# EAGLE design mono mainB (EAGLE 7.4.0)
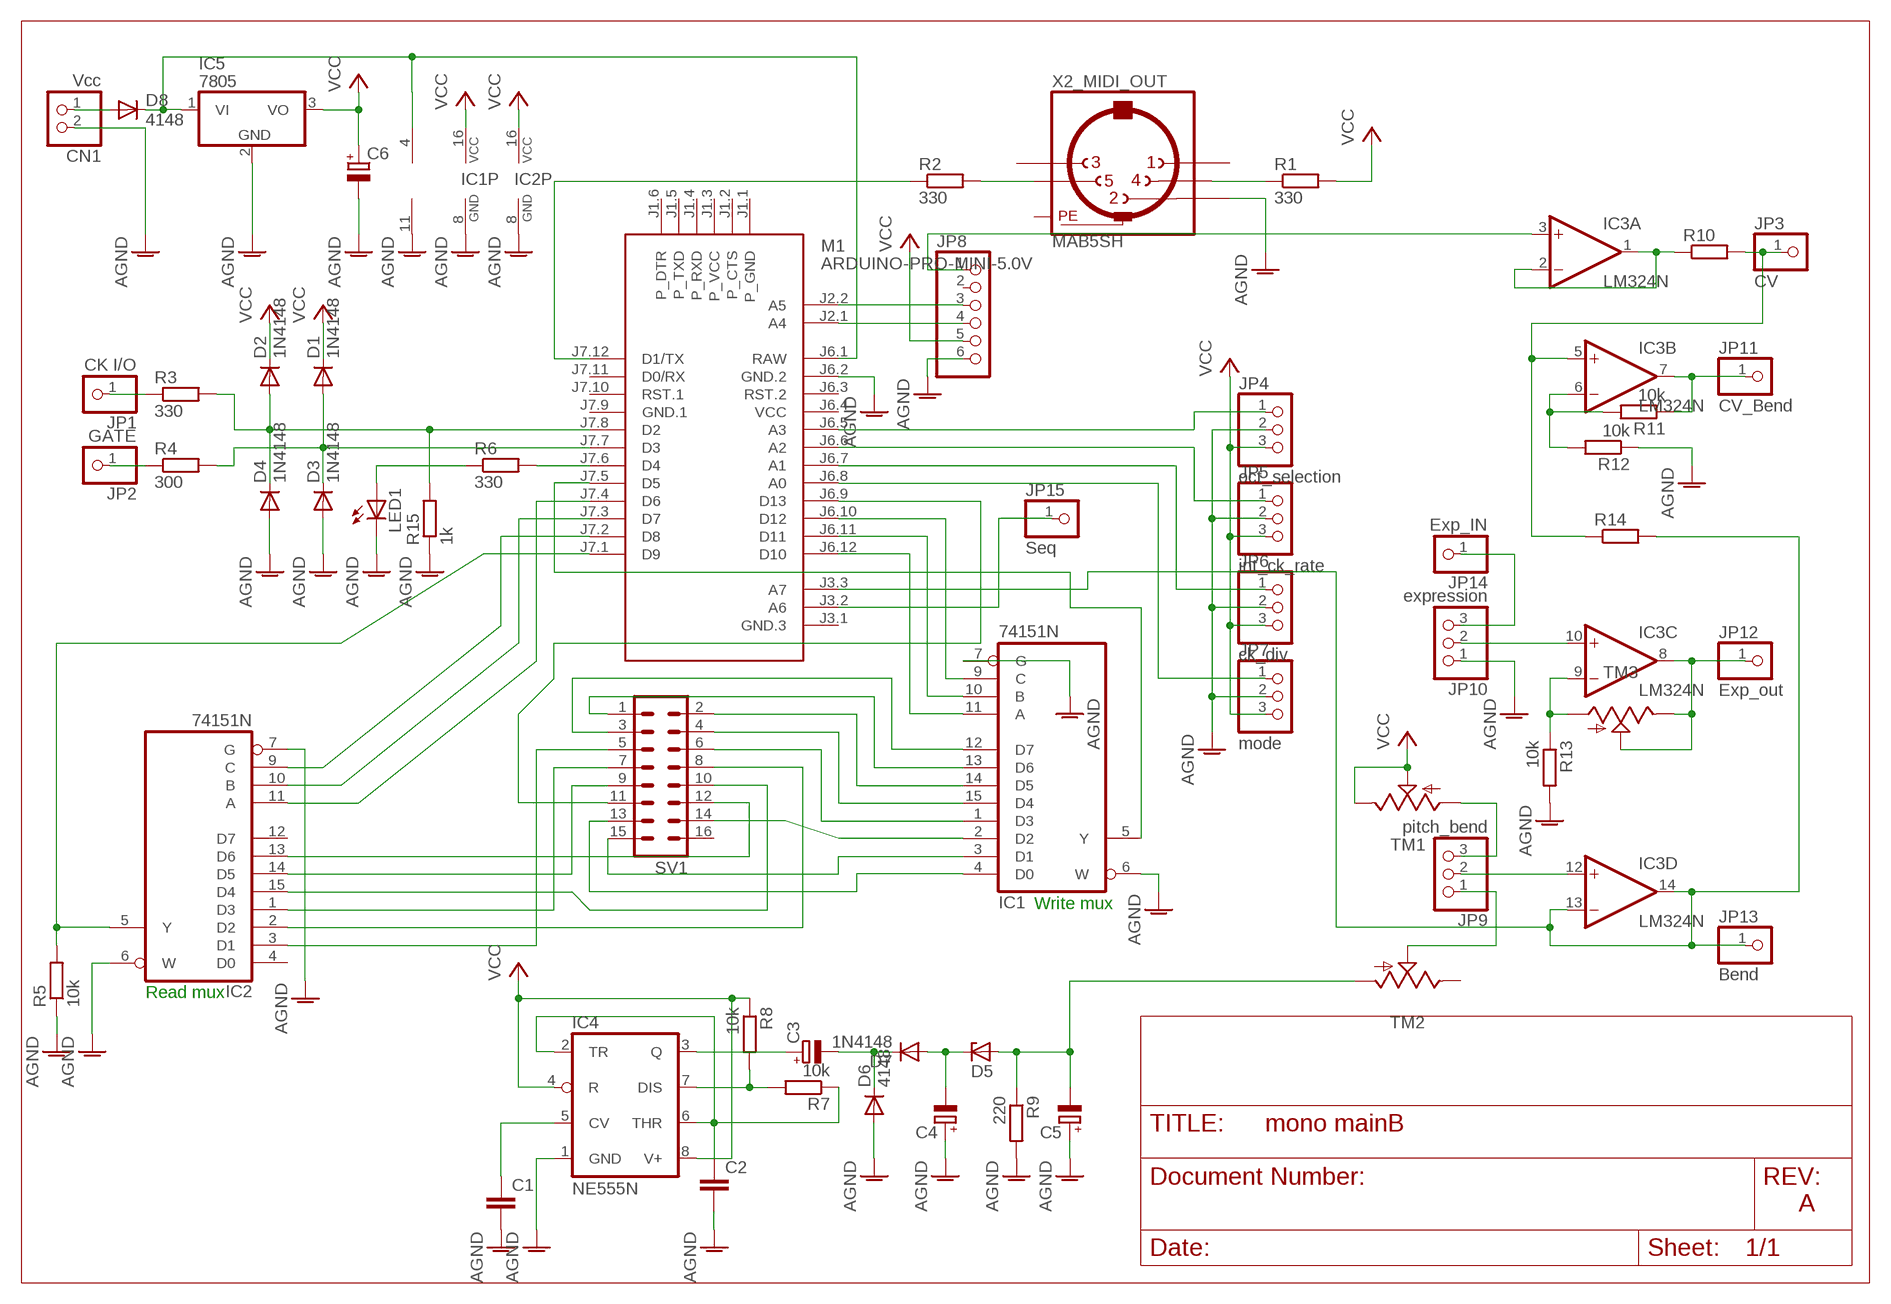
[diagram p0: schematic, sheet 1]

## Parts
C1  C-EU050-025X075  [C050-025X075]
C2  C-EU050-025X075  [C050-025X075]
C3  CPOL-EUE5-8.5  [E5-8,5]
C4  CPOL-EUE5-8.5  [E5-8,5]
C5  CPOL-EUE5-8.5  [E5-8,5]
C6  CPOL-EUE5-8.5  [E5-8,5]
CN1  Vcc  JST_2PIN-THM  [JST-PH-2-THM]
D1  1N4148  1N4148DO35-7  [DO35-7]
D2  1N4148  1N4148DO35-7  [DO35-7]
D3  1N4148  1N4148DO35-7  [DO35-7]
D4  1N4148  1N4148DO35-7  [DO35-7]
D5  ZENER-DIODEZD-7.5  [ZDIO-7.5]
D6  4148  1N4148DO35-7  [DO35-7]
D7  1N4148  1N4148DO35-7  [DO35-7]
D8  4148  1N4148DO35-7  [DO35-7]
IC1  74151N  [DIL16]
IC2  74151N  [DIL16]
IC3  LM324N  [DIL14]
IC4  NE555N  [DIL08-ROUND]
IC5  7805  7805TV  [TO220V]
JP1  CK I/O  PINHD-1X1  [1X01]
JP2  GATE  PINHD-1X1  [1X01]
JP3  CV  PINHD-1X1  [1X01]
JP4  oct_selection  PINHD-1X3  [1X03]
JP5  int_ck_rate  PINHD-1X3  [1X03]
JP6  ck_div  PINHD-1X3  [1X03]
JP7  mode  PINHD-1X3  [1X03]
JP8  PINHD-1X6  [1X06]
JP9  pitch_bend  PINHD-1X3  [1X03]
JP10  expression  PINHD-1X3  [1X03]
JP11  CV_Bend  PINHD-1X1  [1X01]
JP12  Exp_out  PINHD-1X1  [1X01]
JP13  Bend  PINHD-1X1  [1X01]
JP14  Exp_IN  PINHD-1X1  [1X01]
JP15  Seq  PINHD-1X1  [1X01]
LED1  LED5MM  [LED5MM]
M1  ARDUINO-PRO-MINI-5.0V  [ARDUINO-PRO-MINI]
R1  330  R-EU_0204/2V  [0204V]
R2  330  R-EU_0204/7  [0204/7]
R3  330  R0204/7  [0204/7]
R4  300  R0204/7  [0204/7]
R5  10k  R-EU_0204/7  [0204/7]
R6  330  R-EU_0207/10  [0207/10]
R7  10k  R-EU_0204/2V  [0204V]
R8  10k  R-EU_0204/2V  [0204V]
R9  220  R-EU_0204/2V  [0204V]
R10  R0204/7  [0204/7]
R11  10k  R-EU_0204/2V  [0204V]
R12  10k  R-EU_0207/10  [0207/10]
R13  10k  R-EU_0207/10  [0207/10]
R14  R0204/7  [0204/7]
R15  1k  R0204/7  [0204/7]
SV1  MA08-2  [MA08-2]
TM1  TRIM  [6MM]
TM2  TRIM  [6MM]
TM3  TRIM  [6MM]
X2_MIDI_OUT  MAB5SH  [MAB5SH]

## Nets
AGND: C1.2 C2.2 C4.+ C5.+ C6.- CN1.2 D3.A D4.A D6.A IC1.6(W) IC1.7(G) IC1.8(GND) IC2.6(W) IC2.7(G) IC2.8(GND) IC3.11(P:V-) IC4.1(GND) IC5.2(GND) JP4.2 JP5.2 JP6.2 JP7.2 JP8.6 JP10.1 LED1.K(C) M1.J6.2(GND.2) R5.1 R9.2 R12.1 R13.2 R15.1 X2_MIDI_OUT.2
N$1: IC1.12(D7) SV1.3
N$2: IC1.13(D6) SV1.1
N$3: IC1.14(D5) SV1.2
N$4: IC1.15(D4) SV1.4
N$5: IC1.1(D3) SV1.6
N$6: IC1.4(D0) SV1.13
N$7: IC1.2(D2) SV1.14
N$8: IC1.3(D1) SV1.15
N$11: IC2.13(D6) SV1.12
N$12: IC2.14(D5) SV1.9
N$13: IC2.15(D4) SV1.10
N$14: IC2.1(D3) SV1.7
N$15: IC2.2(D2) SV1.8
N$16: JP1.1 R3.1
N$17: IC1.11(A) M1.J6.12(D10)
N$18: IC1.10(B) M1.J6.11(D11)
N$19: M1.J7.12(D1/TX) R2.1
N$20: IC2.3(D1) SV1.5
N$21: JP8.3 M1.J2.2(A5)
N$22: D2.A D4.C M1.J7.8(D2) R3.2 R15.2
N$23: D1.A D3.C M1.J7.7(D3) R4.2
N$24: IC2.5(Y) M1.J7.1(D9) R5.2
N$25: IC1.5(Y) M1.J7.5(D5)
N$26: JP6.1 M1.J6.7(A1)
N$27: JP5.1 M1.J6.6(A2)
N$28: JP2.1 R4.1
N$29: JP8.4 M1.J2.1(A4)
N$30: R2.2 X2_MIDI_OUT.5
N$31: R1.1 X2_MIDI_OUT.4
N$33: IC3.9(C:-IN) R13.1 TM3.A
N$34: JP4.1 M1.J6.5(A3)
N$35: IC2.9(C) M1.J7.2(D8)
N$36: IC2.10(B) M1.J7.3(D7)
N$37: IC2.11(A) M1.J7.4(D6)
N$38: LED1.A R6.1
N$39: M1.J7.6(D4) R6.2
N$40: IC4.7(DIS) R7.2 R8.2
N$41: C2.1 IC4.2(TR) IC4.6(THR) R7.1
N$42: C1.1 IC4.5(CV)
N$43: IC3.1(A:OUT) IC3.2(A:-IN) R10.1
N$44: C3.+ IC4.3(Q)
N$45: C3.- D6.C D7.C
N$46: C4.- D5.C D7.A
N$47: C5.- D5.A R9.1 TM2.A
N$48: IC3.12(D:+IN) JP9.2
N$49: IC3.13(D:-IN) IC3.14(D:OUT) JP13.1 M1.J3.3(A7) R14.2
N$50: JP9.3 TM1.A
N$51: IC3.10(C:+IN) JP10.2
N$52: IC3.8(C:OUT) JP12.1 TM3.E TM3.S
N$53: CN1.1 D8.A
N$54: JP9.1 TM2.S
N$55: IC3.6(B:-IN) R11.2 R12.2
N$56: IC3.7(B:OUT) JP11.1 R11.1
N$57: D8.C IC3.4(P:V+) IC5.1(VI) M1.J6.1(RAW)
N$58: IC1.9(C) M1.J6.10(D12)
N$59: IC3.3(A:+IN) JP8.1
N$60: IC3.5(B:+IN) JP3.1 R10.2 R14.1
N$61: JP10.3 JP14.1
N$62: M1.J6.9(D13) SV1.11
N$67: JP7.1 M1.J6.8(A0)
N$70: JP15.1 M1.J3.2(A6)
VCC: C6.+ D1.C D2.C IC1.16(VCC) IC2.16(VCC) IC4.4(R) IC4.8(V+) IC5.3(VO) JP4.3 JP5.3 JP6.3 JP7.3 JP8.5 R1.2 R8.1 TM1.E TM1.S
Unconnected: IC2.4(D0) IC2.12(D7) JP8.2 M1.J1.1(P_GND) M1.J1.2(P_CTS) M1.J1.3(P_VCC) M1.J1.4(P_RXD) M1.J1.5(P_TXD) M1.J1.6(P_DTR) M1.J3.1(GND.3) M1.J6.3(RST.2) M1.J7.10(RST.1) M1.J7.11(D0/RX) SV1.16 TM2.E X2_MIDI_OUT.1 X2_MIDI_OUT.3

## Notes on the sheet
- Write mux
- Read mux
- A

## Power pins joined to a net without a drawn wire
GND.1: M1.J7.9(GND.1)
PE: X2_MIDI_OUT.PE X2_MIDI_OUT.PE@(PE)
VCC: M1.J6.4(VCC)

## Library data of the parts
C1 C2 = rcl:C-EU: CAPACITOR, European symbol
C3-C6 = rcl:CPOL-EU: POLARIZED CAPACITOR, European symbol
CN1 = adafruit:JST_2PIN: JST 2-Pin Connectors of various flavors SMT-RA (S2B-PH-SM4) 4UConnector #17311 SMT (B2B-PH-SM4) THM-RA (S2B-PH) THM (B2B-PH)
D1-D4 D6-D8 = diode:1N4148: DIODE high speed (Philips)
D5 = diode:ZENER-DIODE: Z-Diode
IC1 IC2 = 74xx-eu:74*151: Data SELECTOR/MULTIPLEXER
IC3 = linear:LM324: OP AMP
IC4 = adafruit:*555: TIMER Changed DIP package to have round (not oval) pin pads http://www.ladyada.net/library/pcb/eaglelibrary.html
IC5 = linear:78*: Positive VOLTAGE REGULATOR Source: http://cache.national.com/ds/LM/LM78L05.pdf http://www.fairchildsemi.com/ds/LM/LM7805.pdf
JP1-JP3 JP11-JP15 = adafruit:PINHD-1X1: Pin header 1x1 for 0.1" spacing With round pins
JP4-JP7 JP9 JP10 = adafruit:PINHD-1X3: PIN HEADER
JP8 = adafruit:PINHD-1X6: PIN HEADER
LED1 = adafruit:LED: LED OSRAM: - CHIPLED LG R971, LG N971, LY N971, LG Q971, LY Q971, LO R971, LY R971 LH N974, LH R974 LS Q976, LO Q976, LY Q976 LO Q996 - Hyper CHIPLED LW Q18S LB Q993, LB Q99A, LB R99A - SideLED LS A670, LO A670, LY A670, LG A670, LP A670 LB A673, LV A673, LT A673, LW A673 LH A674 LY A675 LS A676, LA A676, LO A676, LY A676, LW A676 LS A679, LY A679, LG A679 - Hyper Micro SIDELED® LS Y876, LA Y876, LO Y876, LY Y876 LT Y87S - SmartLED LW L88C, LW L88S LB L89C, LB L89S, LG L890 LS L89K, LO L89K, LY L89K LS L896, LA L896, LO L896, LY L896 - TOPLED LS T670, LO T670, LY T670, LG T670, LP T670 LSG T670, LSP T670, LSY T670, LOP T670, LYG T670 LG T671, LOG T671, LSG T671 LB T673, LV T673, LT T673, LW T673 LH T674 LS T676, LA T676, LO T676, LY T676, LB T676, LH T676, LSB T676, LW T676 LB T67C, LV T67C, LT T67C, LS T67K, LO T67K, LY T67K, LW E67C LS E67B, LA E67B, LO E67B, LY E67B, LB E67C, LV E67C, LT E67C LW T67C LS T679, LY T679, LG T679 LS T770, LO T770, LY T770, LG T770, LP T770 LB T773, LV T773, LT T773, LW T773 LH T774 LS E675, LA E675, LY E675, LS T675 LS T776, LA T776, LO T776, LY T776, LB T776 LHGB T686 LT T68C, LB T68C - Hyper Mini TOPLED® LB M676 - Mini TOPLED Santana® LG M470 LS M47K, LO M47K, LY M47K Source: http://www.osram.convergy.de/
M1 = diy-modules:ARDUINO-PRO-MINI-*: Arduino Pro Mini and compatible devices More details available here: https://www.arduino.cc/en/Main/ArduinoBoardProMini Click here to find device on ebay.com <http://www.ebay.com/sch/arduino+pro+mini>
R1 R2 R5-R9 R11-R13 = rcl:R-EU_: RESISTOR, European symbol
R3 R4 R10 R14 R15 = eagle-ltspice:R: RESISTOR, European symbol; SPICEMODEL: NONE; SPICEPREFIX: R
SV1 = con-lstb:MA08-2: PIN HEADER; OC_FARNELL: unknown; OC_NEWARK: unknown
TM1-TM3 = adafruit:TRIM
X2_MIDI_OUT = con-hirschmann:MAB5SH: Female CONNECTOR 5 pins 90 deg. with shield, horizontal (DIN 41524); OC_FARNELL: 809883; OC_NEWARK: unknown

## Board
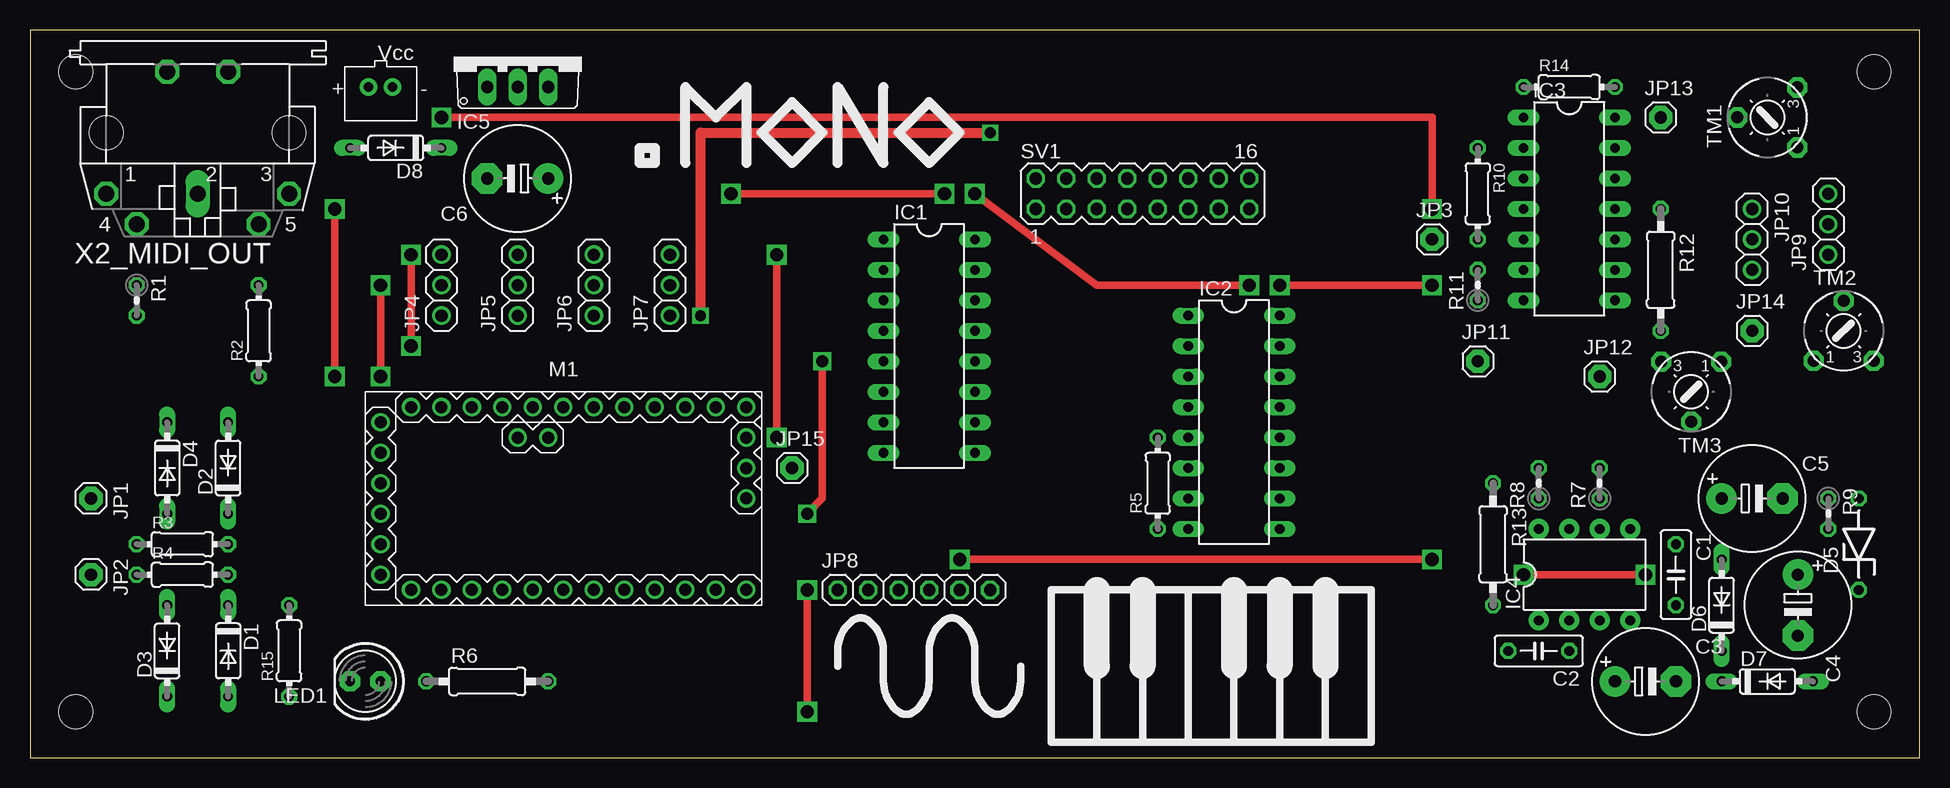
[diagram p1: board, top side]
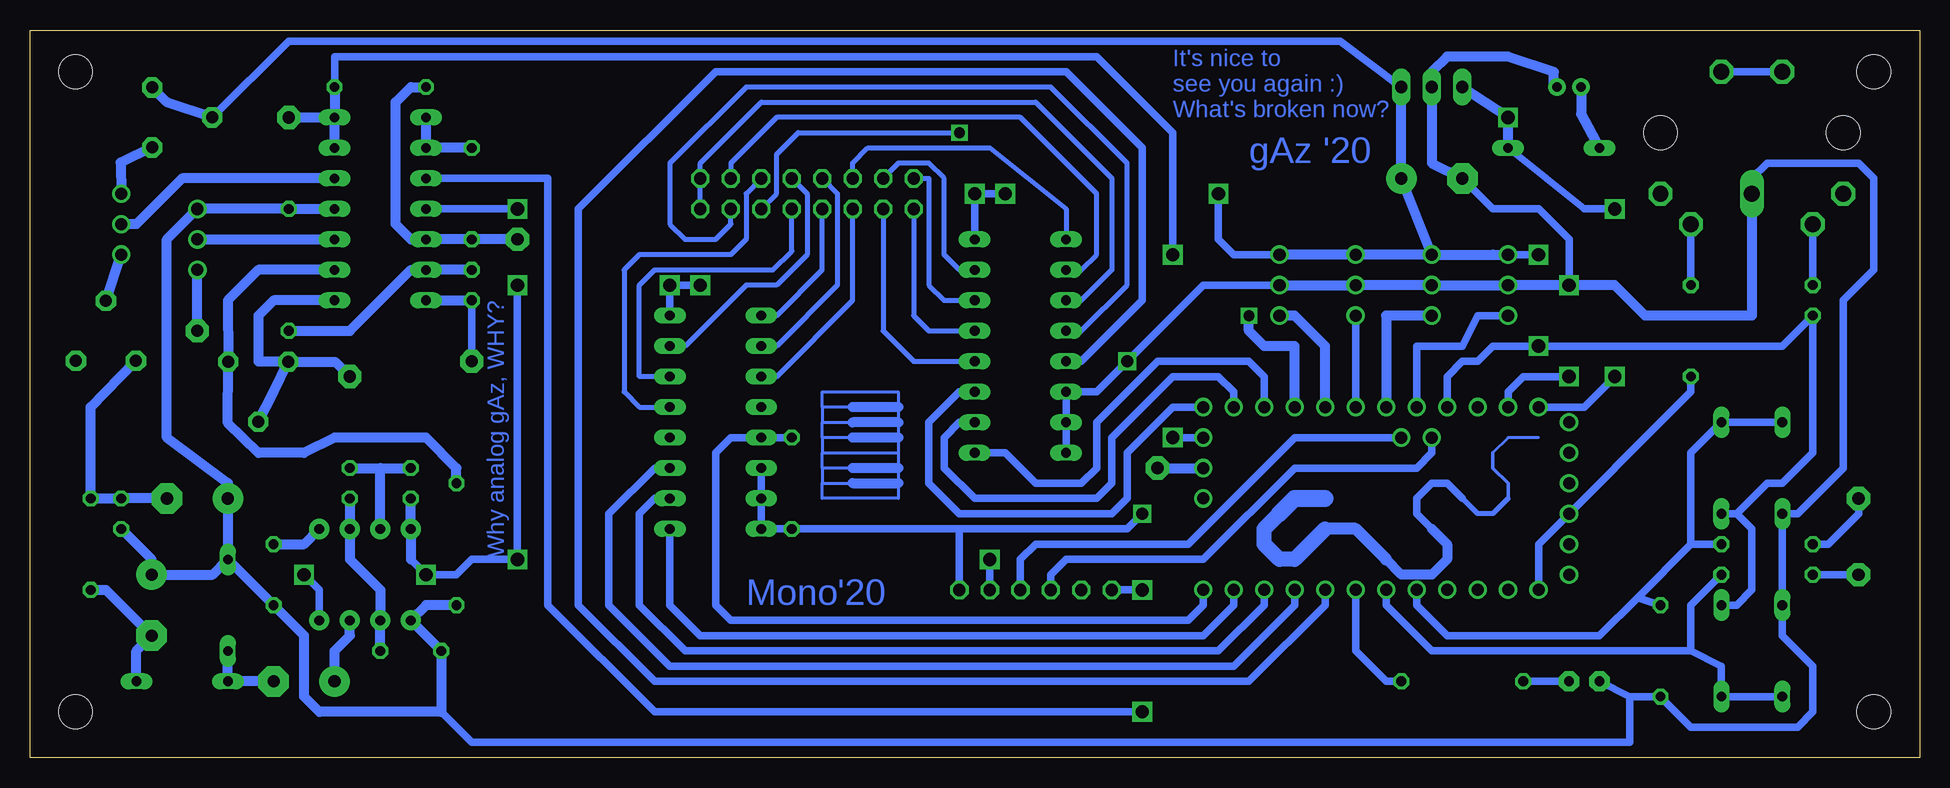
[diagram p2: board, bottom side, seen from below]

Size 157.46 x 60.63 mm. Coordinates in mm from the lower left corner, seen from the top.
Outline: 0,0 157.46,0 157.46,60.63 0,60.63 0,0
Copper layers (1*16): Top 0.035mm / dielectric 1.5mm / Bottom 0.035mm
Design rules "default": minimum track width 10mil, minimum drill 24mil, track to track 8mil, track to pad 8mil, pad to pad 8mil, via to via 8mil, smd to smd 8mil, copper to edge 40mil, drill to drill 8mil, minimum pad ring 10mil, minimum via ring 8mil, stop-mask expansion 4mil, vias tented up to drill 0mil, thermal gap 10mil
Holes 2.8 mm at 3.81,57.15 3.81,3.81 153.67,3.81 153.67,57.15

### Footprints (pad centres in the part's own frame; a part is rotated, then mirrored left to right if it is on the bottom)
C050-025X075 = drill 0.813 octagon: 1 -2.54,0; 2 2.54,0
E5-8,5 = drill 1.016 pad 2.54: + -2.54,0 | drill 1.016 pad 2.54 octagon: - 2.54,0
JST-PH-2-THM = drill 0.8 pad 1.422: 1 1,0; 2 -1,0
DO35-7 = drill 0.813 long: A 3.81,0; C -3.81,0
ZDIO-7.5 = drill 0.813 octagon: A 3.81,0; C -3.81,0
DIL16 = drill 0.813 long: 1 -8.89,-3.81; 2 -6.35,-3.81; 3 -3.81,-3.81; 4 -1.27,-3.81; 5 1.27,-3.81; 6 3.81,-3.81; 7 6.35,-3.81; 8 8.89,-3.81; 9 8.89,3.81; 10 6.35,3.81; 11 3.81,3.81; 12 1.27,3.81; 13 -1.27,3.81; 14 -3.81,3.81; 15 -6.35,3.81; 16 -8.89,3.81
DIL14 = drill 0.813 long: 1 -7.62,-3.81; 2 -5.08,-3.81; 3 -2.54,-3.81; 4 0,-3.81; 5 2.54,-3.81; 6 5.08,-3.81; 7 7.62,-3.81; 8 7.62,3.81; 9 5.08,3.81; 10 2.54,3.81; 11 0,3.81; 12 -2.54,3.81; 13 -5.08,3.81; 14 -7.62,3.81
DIL08-ROUND = drill 0.813 pad 1.676: 1 -3.81,-3.81; 2 -1.27,-3.81; 3 1.27,-3.81; 4 3.81,-3.81; 5 3.81,3.81; 6 1.27,3.81; 7 -1.27,3.81; 8 -3.81,3.81
TO220V = drill 1.016 long: 1 -2.54,-2.54; 2 0,-2.54; 3 2.54,-2.54
1X01 = drill 1.016 pad 1.93 octagon: 1 0,0
1X03 = drill 1.016: 1 -2.54,0; 2 0,0; 3 2.54,0
1X06 = drill 1.016 octagon: 1 -6.35,0; 2 -3.81,0; 3 -1.27,0; 4 1.27,0; 5 3.81,0; 6 6.35,0
LED5MM = drill 0.813 pad 1.676 octagon: A -1.27,0; K 1.27,0
ARDUINO-PRO-MINI = drill 1: J1.1 -15.24,6.35; J1.2 -15.24,3.81; J1.3 -15.24,1.27; J1.4 -15.24,-1.27; J1.5 -15.24,-3.81; J1.6 -15.24,-6.35; J2.1 -1.27,5.08; J2.2 -3.81,5.08; J3.1 15.24,0; J3.2 15.24,2.54; J3.3 15.24,5.08; J6.1 -12.7,7.62; J6.2 -10.16,7.62; J6.3 -7.62,7.62; J6.4 -5.08,7.62; J6.5 -2.54,7.62; J6.6 0,7.62; J6.7 2.54,7.62; J6.8 5.08,7.62; J6.9 7.62,7.62; J6.10 10.16,7.62; J6.11 12.7,7.62; J6.12 15.24,7.62; J7.1 15.24,-7.62; J7.2 12.7,-7.62; J7.3 10.16,-7.62; J7.4 7.62,-7.62; J7.5 5.08,-7.62; J7.6 2.54,-7.62; J7.7 0,-7.62; J7.8 -2.54,-7.62; J7.9 -5.08,-7.62; J7.10 -7.62,-7.62; J7.11 -10.16,-7.62; J7.12 -12.7,-7.62
0204V = drill 0.813 octagon: 1 -1.27,0; 2 1.27,0
0204/7 = drill 0.813 octagon: 1 -3.81,0; 2 3.81,0
0207/10 = drill 0.813 octagon: 1 -5.08,0; 2 5.08,0
MA08-2 = drill 1.016 octagon: 1 -8.89,-1.27; 2 -8.89,1.27; 3 -6.35,-1.27; 4 -6.35,1.27; 5 -3.81,-1.27; 6 -3.81,1.27; 7 -1.27,-1.27; 8 -1.27,1.27; 9 1.27,-1.27; 10 1.27,1.27; 11 3.81,-1.27; 12 3.81,1.27; 13 6.35,-1.27; 14 6.35,1.27; 15 8.89,-1.27; 16 8.89,1.27
6MM = drill 1 pad 1.676 octagon: A -2.5,-2.5; E 2.5,-2.5; S 0,2.5
MAB5SH = drill 1.321 octagon: 1 7.62,5.08; 3 -7.62,5.08; 4 5.08,7.62; 5 -5.08,7.62; PE -2.54,-5.08; PE@ 2.54,-5.08 | drill 1.321 long: 2 0,5.08 | hole 2.794: 7.62,0; -7.62,0

### Placement (x,y rotation side)
C1  137.16,15.24 270 top
C2  125.73,8.89 180 top
C3  134.62,6.35 0 top
C4  147.32,12.7 270 top
C5  143.51,21.59 0 top
C6  40.64,48.26 180 top
CN1  29.21,55.88 180 top
D1  16.51,8.89 270 top
D2  16.51,24.13 90 top
D3  11.43,8.89 90 top
D4  11.43,24.13 270 top
D5  152.4,17.78 90 top
D6  140.97,12.7 90 top
D7  144.78,6.35 0 top
D8  30.48,50.8 180 top
IC1  74.93,34.29 270 top
IC2  100.33,27.94 270 top
IC3  128.27,45.72 270 top
IC4  129.54,15.24 0 top
IC5  40.64,58.42 0 top
JP1  5.08,21.59 270 top
JP2  5.08,15.24 270 top
JP3  116.84,43.18 0 top
JP4  34.29,39.37 90 top
JP5  40.64,39.37 90 top
JP6  46.99,39.37 90 top
JP7  53.34,39.37 90 top
JP8  73.66,13.97 0 top
JP9  149.86,44.45 90 top
JP10  143.51,43.18 270 top
JP11  120.65,33.02 0 top
JP12  130.81,31.75 0 top
JP13  135.89,53.34 0 top
JP14  143.51,35.56 0 top
JP15  63.5,24.13 0 top
LED1  27.94,6.35 180 top
M1  44.45,21.59 0 top
R1  [0204V]  8.89,38.1 270 top
R2  [0204/7]  19.05,35.56 90 top
R3  12.7,17.78 0 top
R4  12.7,15.24 0 top
R5  93.98,22.86 90 top
R6  38.1,6.35 0 top
R7  130.81,22.86 90 top
R8  125.73,22.86 90 top
R9  149.86,20.32 270 top
R10  120.65,46.99 270 top
R11  120.65,39.37 90 top
R12  135.89,40.64 270 top
R13  121.92,17.78 270 top
R14  128.27,55.88 0 top
R15  21.59,8.89 90 top
SV1  92.71,46.99 0 top
TM1  144.78,53.34 90 top
TM2  151.13,35.56 0 top
TM3  138.43,30.48 180 top
X2_MIDI_OUT  13.97,52.07 180 top

### Tracks (layer width: path | path; a pad name or v marks a point on that pad's centre or on a via)
AGND  (via drill 1, 1.1)
  Top 0.61: v29.21,31.75 v29.21,39.37 | v66.04,33.02 66.04,21.59 v64.77,20.32
  Bottom 0.61: IC1.6 IC1.7 IC1.8 IC1.6 | IC2.6 IC2.7 IC2.8 R5.1 80.01,19.05 | 80.01,19.05 66.04,19.05 v64.77,20.32 | 80.01,19.05 JP8.6 | JP7.2 59.69,39.37 v66.04,33.02 68.58,30.48 IC1.6 | 123.19,3.81 120.65,1.27 24.13,1.27 24.13,5.08 | X2_MIDI_OUT.2 13.97,48.26 12.7,49.53 5.08,49.53 3.81,48.26 3.81,40.64 6.35,38.1 6.35,24.13 10.16,20.32 D4.A D3.A 11.43,10.16 8.89,7.62 8.89,3.81 10.16,2.54 19.05,2.54 R15.1 24.13,5.08 | C6.- 35.56,45.72 31.75,45.72 29.21,43.18 v29.21,39.37 | M1.J6.2 34.29,30.48 33.02,31.75 v29.21,31.75 | LED1.K 24.13,5.08
  Bottom 0.813: IC3.11 R12.1 JP10.1 146.05,43.18 146.05,26.67 140.97,22.86 C5.+ D6.A | C6.- 40.64,49.53 IC5.2 40.64,57.15 39.37,58.42 34.29,58.42 30.48,57.15 30.48,55.88 30.21,55.61 CN1.2 | D6.A 142.24,15.24 C4.+ 147.32,16.51 R9.2 | D6.A C1.2 134.62,10.16 134.62,5.08 133.35,3.81 123.19,3.81 C2.2 IC4.1 124.46,12.7 R13.2 | X2_MIDI_OUT.2 13.97,36.83 22.86,36.83 25.4,39.37 v29.21,39.37 JP4.2 JP5.2 JP6.2 JP7.2
N$1
  Bottom 0.406: SV1.3 86.36,35.56 83.82,33.02 IC1.12
N$2
  Bottom 0.406: SV1.1 83.82,36.83 82.55,35.56 IC1.13
N$3
  Bottom 0.406: SV1.2 82.55,48.26 82.55,39.37 81.28,38.1 IC1.14
N$4
  Bottom 0.406: IC1.15 80.01,40.64 81.28,41.91 81.28,48.26 82.55,49.53 85.09,49.53 SV1.4
N$5
  Bottom 0.406: SV1.6 88.9,49.53 87.63,50.8 77.47,50.8 71.12,45.72 IC1.1
N$6
  Bottom 0.406: IC1.4 69.85,35.56 66.04,39.37 66.04,49.53 72.39,55.88 97.79,55.88 104.14,49.53 104.14,44.45 102.87,43.18 100.33,43.18 99.06,44.45 SV1.13
N$7
  Bottom 0.406: IC1.2 69.85,40.64 68.58,41.91 68.58,46.99 74.93,53.34 95.25,53.34 99.06,49.53 SV1.14
N$8
  Bottom 0.406: SV1.15 101.6,49.53 96.52,54.61 73.66,54.61 67.31,48.26 67.31,40.64 69.85,38.1 IC1.3
N$11
  Bottom 0.406: SV1.12 97.79,46.99 97.79,43.18 99.06,41.91 106.68,41.91 107.95,40.64 107.95,30.48 106.68,29.21 IC2.13
N$12
  Bottom 0.406: IC2.14 106.68,31.75 106.68,39.37 105.41,40.64 95.55,40.64 93.98,42.21 SV1.9
N$13
  Bottom 0.406: SV1.10 92.71,46.99 92.71,41.91 95.25,39.37 97.79,39.37 102.87,34.29 IC2.15
N$14
  Bottom 0.406: IC2.1 95.25,36.83 91.44,40.64 SV1.7
N$15
  Bottom 0.406: SV1.8 90.17,46.99 90.17,39.37 95.25,34.29 IC2.2
N$16
  Bottom 0.61: R3.1 7.62,17.78 5.08,20.32 JP1.1
N$17
  Bottom 0.61: IC1.11 80.01,30.48 82.55,27.94 82.55,22.86 80.01,20.32 67.31,20.32 66.04,21.59 66.04,25.4 62.23,29.21 M1.J6.12
N$18
  Bottom 0.61: M1.J6.11 57.15,30.48 58.42,31.75 62.23,31.75 67.31,26.67 67.31,22.86 68.58,21.59 78.74,21.59 81.28,24.13 81.28,26.67 80.01,27.94 IC1.10
N$19
  Bottom 0.61: R2.1 19.05,30.48 31.75,17.78 M1.J7.12
N$20
  Bottom 0.406: IC2.3 95.25,31.75 88.9,38.1 SV1.5
N$21
  Bottom 0.61: M1.J2.2 40.64,25.4 41.91,24.13 52.07,24.13 59.69,16.51 71.12,16.51 72.39,15.24 JP8.3
N$22
  Bottom 0.61: 19.05,17.78 19.05,25.4 D2.A D4.C | 19.05,17.78 R3.2 | M1.J7.8 41.91,12.7 39.37,10.16 26.67,10.16 23.5,13.34 | 23.5,13.34 19.05,17.78 | R15.2 23.5,13.34
N$23
  Bottom 0.61: D3.C D1.A 16.51,7.62 19.05,8.89 | R4.2 19.05,12.7 19.05,8.89 | 19.05,8.89 40.64,8.89 44.45,12.7 M1.J7.7
N$24
  Bottom 0.61: R5.2 IC2.5 99.06,26.67 100.33,25.4 100.33,12.7 99.06,11.43 60.96,11.43 59.69,12.7 M1.J7.1
N$25
  Bottom 0.61: M1.J7.5 49.53,12.7 55.88,6.35 105.41,6.35 111.76,12.7 111.76,45.72 100.33,57.15 71.12,57.15 64.77,50.8 64.77,38.1 69.85,33.02 IC1.5
N$26
  Bottom 0.61: JP6.1 M1.J6.7
N$27
  Bottom 0.813: JP5.1 44.45,36.83 M1.J6.6
N$28
  Bottom 0.61: R4.1 JP2.1
N$29
  Bottom 0.61: JP8.4 74.93,16.51 73.66,17.78 60.96,17.78 52.07,26.67 M1.J2.1
N$30
  Bottom 0.61: X2_MIDI_OUT.5 R2.2
N$31
  Bottom 0.61: X2_MIDI_OUT.4 R1.1
N$33
  Bottom 0.813: IC3.9 138.43,40.64 140.97,38.1 TM3.A 140.97,27.86 138.43,25.4 134.62,25.4 132.08,26.67 124.46,26.67 121.92,24.13 R13.1
N$34
  Bottom 0.61: JP4.1 36.83,36.83 38.1,34.29 41.91,34.29 M1.J6.5
N$35
  Bottom 0.61: IC2.9 104.14,12.7 101.6,10.16 59.69,10.16 57.15,12.7 M1.J7.2
N$36
  Bottom 0.61: IC2.10 105.41,21.59 106.68,20.32 106.68,12.7 102.87,8.89 58.42,8.89 54.61,12.7 M1.J7.3
N$37
  Bottom 0.61: IC2.11 105.41,24.13 109.22,20.32 109.22,12.7 104.14,7.62 57.15,7.62 52.07,12.7 M1.J7.4
N$38
  Bottom 0.61: R6.1 LED1.A
N$39
  Bottom 0.61: R6.2 44.45,6.35 46.99,8.89 M1.J7.6
N$40
  Bottom 0.813: IC4.7 128.27,24.13 | 128.27,24.13 R8.2 | R7.2 128.27,24.13
N$41
  Bottom 0.813: R7.1 IC4.6 130.81,16.51 128.27,13.97 IC4.2 C2.1
N$42
  Bottom 0.813: C1.1 134.62,17.78 IC4.5
N$43
  Bottom 0.813: R10.1 IC3.2 IC3.1
N$44
  Bottom 0.813: C3.+ 132.08,8.89 130.81,10.16 IC4.3
N$45
  Bottom 0.813: C3.- D7.C D6.C
N$46
  Bottom 0.813: D7.A 148.59,8.89 C4.- 151.13,13.97 D5.C
N$47
  Bottom 0.813: C5.- R9.1 D5.A 152.4,29.21 TM2.A
N$48
  Bottom 0.813: IC3.12 144.78,48.26 148.59,44.45 JP9.2
N$49  (via drill 1.1)
  Top 0.61: v62.23,41.91 v62.23,26.67
  Bottom 0.61: IC3.13 132.08,58.42 68.58,58.42 62.23,52.07 v62.23,41.91 | v62.23,26.67 M1.J3.3
  Bottom 0.813: IC3.13 IC3.14 | JP13.1 IC3.14 | R14.2 IC3.14
N$50
  Bottom 0.813: TM1.A 149.9,49.57 JP9.3
N$51
  Bottom 0.813: JP10.2 IC3.10
N$52
  Bottom 0.813: IC3.8 137.16,38.1 138.43,36.83 138.43,33.02 135.97,33.02 TM3.E | TM3.S 137.16,30.48 TM3.E | TM3.E 132.04,32.98 JP12.1
N$53
  Bottom 0.813: CN1.1 28.21,53.61 D8.A
N$54
  Bottom 0.813: TM2.S 149.9,41.87 JP9.1
N$55
  Bottom 0.813: R11.2 IC3.6 125.73,40.64 130.81,35.56 R12.2
N$56
  Bottom 0.61: JP11.1 R11.1
  Bottom 0.813: IC3.7 R11.1
N$57  (via drill 1.1)
  Top 0.61: v25.4,31.75 v25.4,45.72 | v116.84,45.72 116.84,53.34 v34.29,53.34
  Bottom 0.61: M1.J6.1 27.94,29.21 v25.4,31.75 | v25.4,45.72 27.94,45.72 D8.C | IC3.4 v116.84,45.72
  Bottom 0.813: D8.C v34.29,53.34 IC5.1
N$58
  Bottom 0.61: IC1.9 76.2,25.4 73.66,22.86 69.85,22.86 68.58,24.13 68.58,27.94 63.5,33.02 55.88,33.02 54.61,31.75 M1.J6.10
N$59  (via drill 1.1)
  Top 0.61: v64.77,13.97 v64.77,3.81
  Bottom 0.61: JP8.1 v64.77,13.97 | v64.77,3.81 105.41,3.81 114.3,12.7 114.3,48.26 IC3.3
N$60
  Bottom 0.813: JP3.1 R10.2 IC3.5 125.73,43.18 127,44.45 127,54.61 125.73,55.88 R14.1
N$61
  Bottom 0.813: JP14.1 JP10.3
N$62  (via drill 0.9)
  Top 0.813: v55.88,36.83 55.88,52.07 v80.01,52.07
  Bottom 0.406: SV1.11 95.25,46.99 95.25,50.27 93.45,52.07 v80.01,52.07
  Bottom 0.813: M1.J6.9 52.07,34.29 54.61,34.29 55.88,35.56 v55.88,36.83
N$67
  Bottom 0.813: M1.J6.8 49.53,34.29 52.07,36.83 JP7.1
N$70
  Bottom 0.813: JP15.1 M1.J3.2
N$71
  Bottom 0.254: 85.09,25.4 85.09,26.67 85.09,27.94 85.09,29.21 85.09,30.48 91.44,30.48 91.44,29.21 | 91.44,22.86 91.44,21.59 85.09,21.59 85.09,22.86 85.09,24.13 85.09,25.4 | 91.44,24.13 91.44,25.4 | 91.44,26.67 91.44,27.94 | 88.9,29.21 91.44,29.21 | 91.44,29.21 91.44,27.94 | 91.44,27.94 88.9,27.94 | 88.9,26.67 91.44,26.67 | 91.44,26.67 91.44,25.4 | 91.44,25.4 85.09,25.4 | 88.9,24.13 91.44,24.13 | 91.44,24.13 91.44,22.86 | 91.44,22.86 88.9,22.86
  Bottom 0.813: 88.9,22.86 85.09,22.86 | 85.09,24.13 88.9,24.13 | 85.09,26.67 88.9,26.67 | 85.09,27.94 88.9,27.94 | 85.09,29.21 88.9,29.21
N$72
  Bottom 0.254: 31.75,26.67 34.29,26.67 35.56,25.4
  Bottom 0.305: 35.56,25.4 35.56,24.13 34.29,22.86 34.29,21.59
  Bottom 0.406: 34.29,21.59 35.56,20.32 36.83,20.32 38.1,21.59
  Bottom 0.61: 38.1,21.59 39.37,22.86 40.64,22.86 41.91,21.59 41.91,20.32 40.64,19.05
  Bottom 0.813: 40.64,19.05 39.37,17.78 39.37,16.51 40.64,15.24 43.18,15.24 44.45,16.51
  Bottom 1.016: 44.45,16.51 46.99,19.05 49.53,19.05
  Bottom 1.27: 49.53,19.05 52.07,16.51 53.34,16.51 54.61,17.78 54.61,19.05 53.34,20.32
  Bottom 1.422: 53.34,20.32 52.07,21.59 49.53,21.59
PE
  Bottom 0.61: X2_MIDI_OUT.PE X2_MIDI_OUT.PE@
VCC  (via drill 1.1)
  Top 0.61: v31.75,34.29 v31.75,41.91 | v58.42,46.99 v76.2,46.99 | v101.6,39.37 88.9,39.37 v78.74,46.99 | v134.62,15.24 v124.46,15.24 | v77.47,16.51 v116.84,16.51 | v116.84,39.37 v104.14,39.37
  Bottom 0.61: 15.24,20.32 13.97,19.05 13.97,13.97 15.24,12.7 D1.C | D2.C 15.24,20.32 | 15.24,20.32 12.7,22.86 11.43,22.86 8.89,25.4 R1.2 11.43,34.29 v31.75,34.29 35.56,34.29 36.83,33.02 38.1,33.02 39.37,31.75 M1.J6.4 | v31.75,41.91 35.56,41.91 | JP7.3 57.15,41.91 58.42,43.18 v58.42,46.99 | v76.2,46.99 v78.74,46.99 IC1.16 | IC2.16 v104.14,39.37 v101.6,39.37 | JP8.5 v77.47,16.51 | 125.73,16.51 v124.46,15.24 121.92,15.24 120.65,16.51 v116.84,16.51 v116.84,39.37 | IC4.4 133.35,13.97 v134.62,15.24 | TM1.S 135.89,59.69 48.26,59.69 IC5.3
  Bottom 0.813: TM1.S 146.05,54.61 TM1.E | IC5.3 C6.+ JP5.3 | 125.73,16.51 IC4.8 R8.1 | JP5.3 JP6.3 JP7.3 | JP5.3 35.56,41.91 JP4.3

### Text on the board
Bottom: It's nice to / see you again :) / What's broken now? | gAz '20 | Why analog gAz, WHY? | '20 | Mono